# EAGLE design second session (EAGLE 9.6.2)
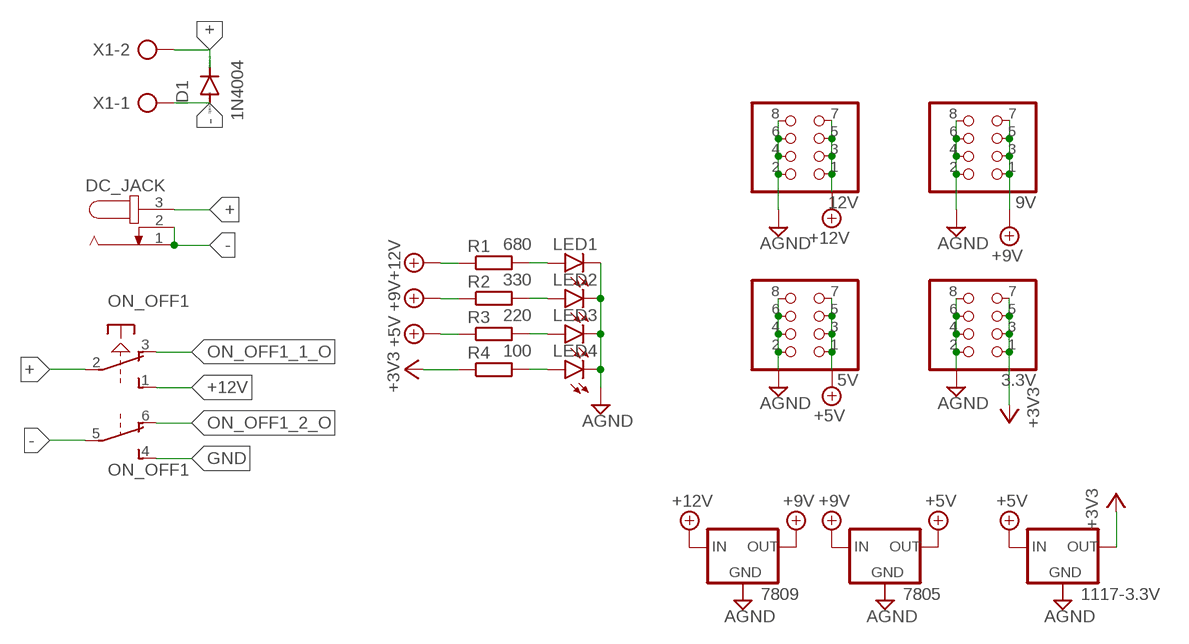
[diagram p0: schematic, sheet 1]

## Parts
3.3V  PINHD-2X4  [2X04]
5V  PINHD-2X4  [2X04]
9V  PINHD-2X4  [2X04]
12V  PINHD-2X4  [2X04]
1117-3.3V  78XXS  [78XXS]
7805  78XXS  [78XXS]
7809  78XXS  [78XXS]
D1  1N4004  [DO41-10]
DC_JACK  JACK-PLUG0  [SPC4077]
LED1  LED5MM  [LED5MM]
LED2  LED5MM  [LED5MM]
LED3  LED5MM  [LED5MM]
LED4  LED5MM  [LED5MM]
ON_OFF1  PVA2R  [PVA2R]
R1  680  R-EU_0207/10  [0207/10]
R2  330  R-EU_0207/10  [0207/10]
R3  220  R-EU_0207/10  [0207/10]
R4  100  R-EU_0207/10  [0207/10]
X1  AK500/2-H  [AK500/2-H]

## Nets
+: D1.C DC_JACK.3 ON_OFF1.2(1:P) X1.2
+3V3: 3.3V.1 3.3V.3 3.3V.5 3.3V.7 1117-3.3V.OUT R4.1
+5V: 5V.1 5V.3 5V.5 5V.7 1117-3.3V.IN 7805.OUT R3.1
+9V: 9V.1 9V.3 9V.5 9V.7 7805.IN 7809.OUT R2.1
+12V: 12V.1 12V.3 12V.5 12V.7 7809.IN ON_OFF1.1(1:S) R1.1
-: D1.A DC_JACK.1 DC_JACK.2 ON_OFF1.5(2:P) X1.1
AGND: 3.3V.2 3.3V.4 3.3V.6 3.3V.8 5V.2 5V.4 5V.6 5V.8 9V.2 9V.4 9V.6 9V.8 12V.2 12V.4 12V.6 12V.8 LED1.K(C) LED2.K(C) LED3.K(C) LED4.K(C)
GND: ON_OFF1.4(2:S)
N$1: LED1.A R1.2
N$2: LED2.A R2.2
N$3: LED3.A R3.2
N$4: LED4.A R4.2
ON_OFF1_1_O: ON_OFF1.3(1:O)
ON_OFF1_2_O: ON_OFF1.6(2:O)
Unconnected: 1117-3.3V.GND 7805.GND 7809.GND

## Library data of the parts
3.3V 5V 9V 12V = pinhead:PINHD-2X4: PIN HEADER
1117-3.3V 7805 7809 = v-reg:78XXS: VOLTAGE REGULATOR
D1 = diode:1N4004: DIODE general purpose rectifier, 1 A
DC_JACK = con-jack:JACK-PLUG: DC POWER JACK Power Jack, DC, Right Angle, Through Hole, Rated 5A at 16VDC, PC Terminals Distributor: Farnell (www.Farnell.de) Drawing: 84N1161.pdf / 84N1162.pdf Manufacturer: SPC Technology (www.spctechnology.com) Type: SPC4077 / SPC 4078; OC_FARNELL: unknown; OC_NEWARK: unknown
LED1-LED4 = led:LED: LED OSRAM: - CHIPLED LG R971, LG N971, LY N971, LG Q971, LY Q971, LO R971, LY R971 LH N974, LH R974 LS Q976, LO Q976, LY Q976 LO Q996 - Hyper CHIPLED LW Q18S LB Q993, LB Q99A, LB R99A - SideLED LS A670, LO A670, LY A670, LG A670, LP A670 LB A673, LV A673, LT A673, LW A673 LH A674 LY A675 LS A676, LA A676, LO A676, LY A676, LW A676 LS A679, LY A679, LG A679 - Hyper Micro SIDELED® LS Y876, LA Y876, LO Y876, LY Y876 LT Y87S - SmartLED LW L88C, LW L88S LB L89C, LB L89S, LG L890 LS L89K, LO L89K, LY L89K LS L896, LA L896, LO L896, LY L896 - TOPLED LS T670, LO T670, LY T670, LG T670, LP T670 LSG T670, LSP T670, LSY T670, LOP T670, LYG T670 LG T671, LOG T671, LSG T671 LB T673, LV T673, LT T673, LW T673 LH T674 LS T676, LA T676, LO T676, LY T676, LB T676, LH T676, LSB T676, LW T676 LB T67C, LV T67C, LT T67C, LS T67K, LO T67K, LY T67K, LW E67C LS E67B, LA E67B, LO E67B, LY E67B, LB E67C, LV E67C, LT E67C LW T67C LS T679, LY T679, LG T679 LS T770, LO T770, LY T770, LG T770, LP T770 LB T773, LV T773, LT T773, LW T773 LH T774 LS E675, LA E675, LY E675, LS T675 LS T776, LA T776, LO T776, LY T776, LB T776 LHGB T686 LT T68C, LB T68C - Hyper Mini TOPLED® LB M676 - Mini TOPLED Santana® LG M470 LS M47K, LO M47K, LY M47K Source: http://www.osram.convergy.de LUXEON: - LUMILED® LXK2-PW12-R00, LXK2-PW12-S00, LXK2-PW14-U00, LXK2-PW14-V00 LXK2-PM12-R00, LXK2-PM12-S00, LXK2-PM14-U00 LXK2-PE12-Q00, LXK2-PE12-R00, LXK2-PE12-S00, LXK2-PE14-T00, LXK2-PE14-U00 LXK2-PB12-K00, LXK2-PB12-L00, LXK2-PB12-M00, LXK2-PB14-N00, LXK2-PB14-P00, LXK2-PB14-Q00 LXK2-PR12-L00, LXK2-PR12-M00, LXK2-PR14-Q00, LXK2-PR14-R00 LXK2-PD12-Q00, LXK2-PD12-R00, LXK2-PD12-S00 LXK2-PH12-R00, LXK2-PH12-S00 LXK2-PL12-P00, LXK2-PL12-Q00, LXK2-PL12-R00 Source: www.luxeon.com KINGBRIGHT: KA-3528ASYC Source: www.kingbright.com
ON_OFF1 = switch-misc:PVA2R: ITT SWITCH
R1-R4 = rcl:R-EU_: RESISTOR, European symbol; SPICEPREFIX: R
X1 = con-ptr500:AK500/2-H: CONNECTOR Aug. 2004 / PTR Meßtechnik: Die Bezeichnung der Serie AK505 wurde geändert. Es handelt sich hierbei um AK500 in horizontaler Ausführung.; OC_FARNELL: unknown; OC_NEWARK: unknown

## Board
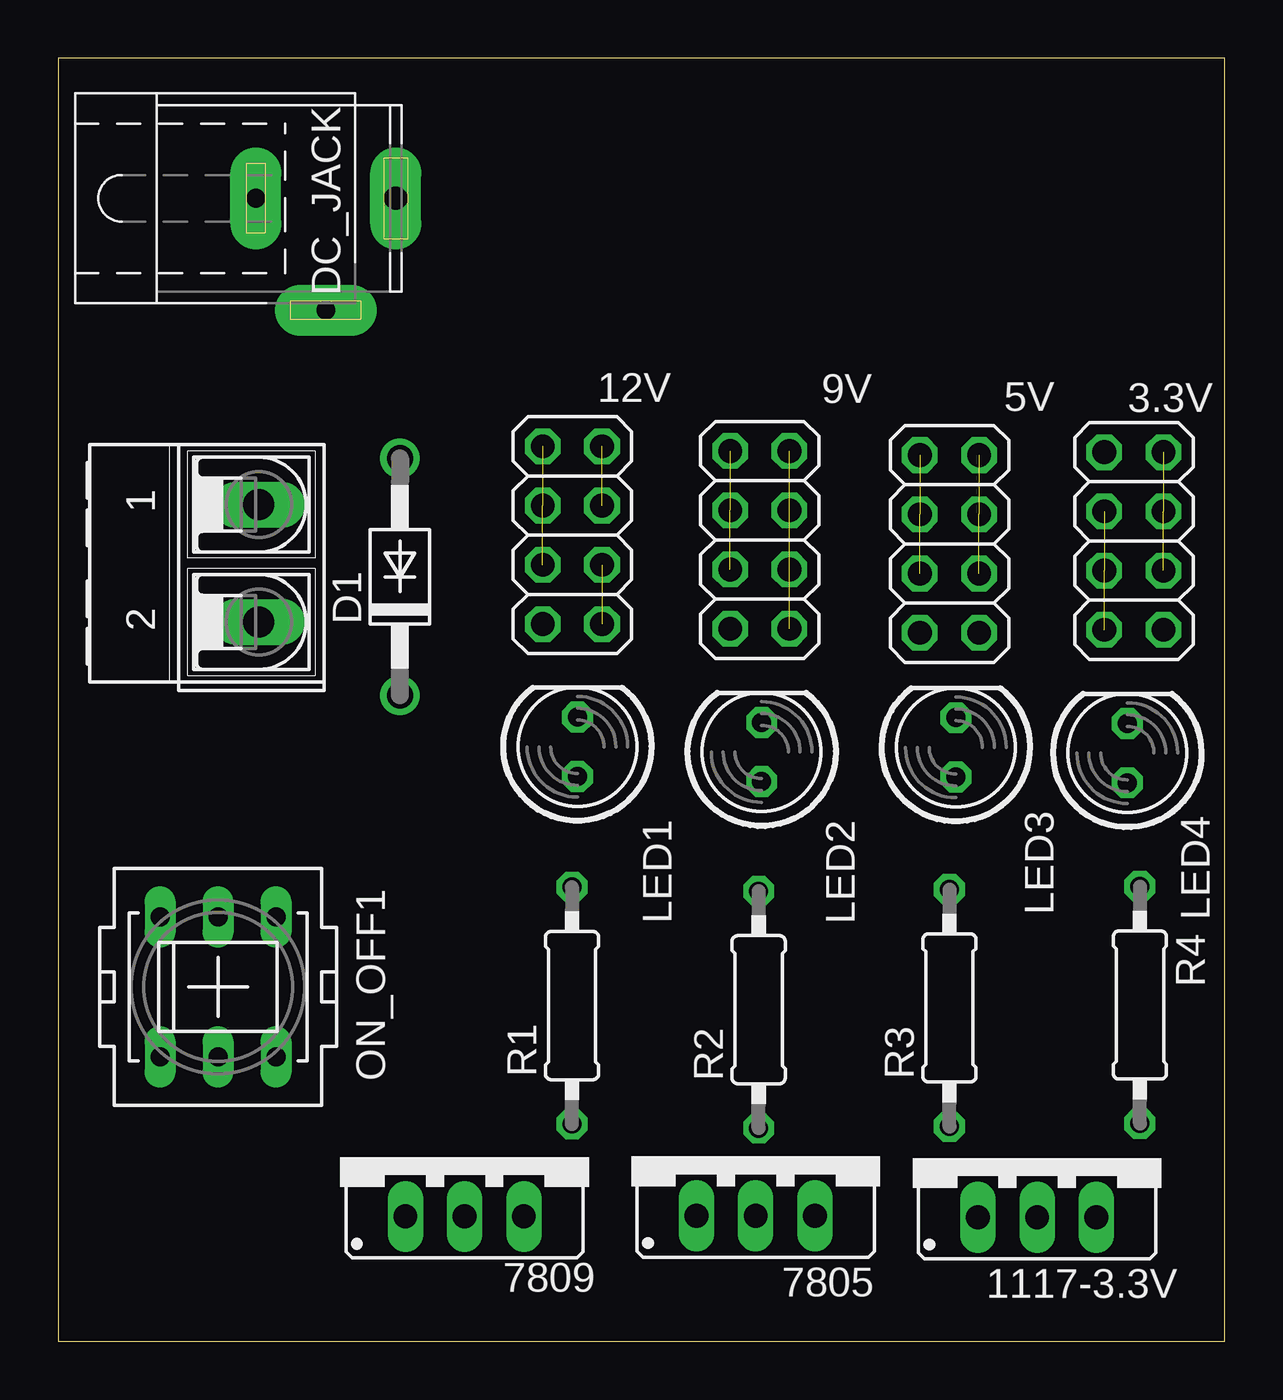
[diagram p1: board, top side]
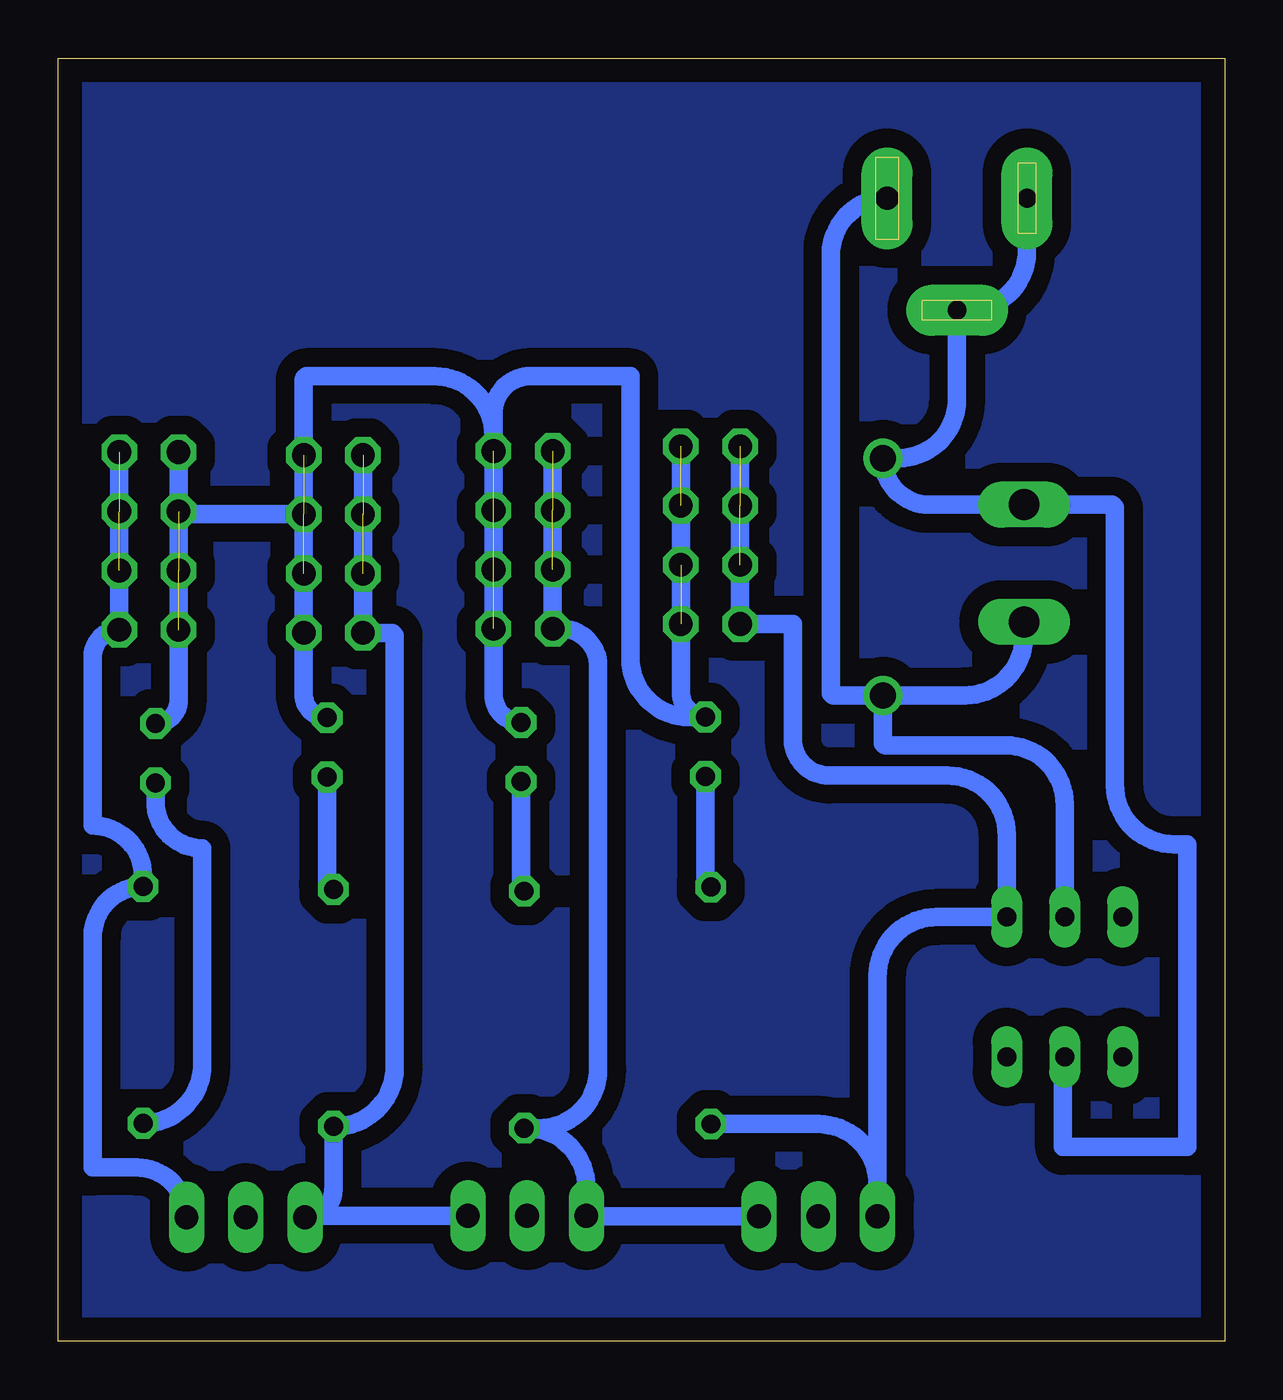
[diagram p2: board, bottom side, seen from below]

Size 50 x 55 mm. Coordinates in mm from the lower left corner, seen from the top.
Outline: 0,0 50,0 50,55 0,55 0,0
Copper layers (1*16): Top 0.035mm / dielectric 1.5mm / Bottom 0.035mm
Design rules "default *": minimum track width 0.8mm, minimum drill 0.7mm, track to track 0.6mm, track to pad 0.6mm, pad to pad 0.6mm, via to via 0.6mm, smd to smd 0.6mm, copper to edge 40mil, drill to drill 6mil, minimum pad ring 10mil, minimum via ring 8mil, stop-mask expansion 4mil, vias tented up to drill 0mil, thermal gap 10mil

### Footprints (pad centres in the part's own frame; a part is rotated, then mirrored left to right if it is on the bottom)
2X04 = drill 1.016 octagon: 1 -3.81,-1.27; 2 -3.81,1.27; 3 -1.27,-1.27; 4 -1.27,1.27; 5 1.27,-1.27; 6 1.27,1.27; 7 3.81,-1.27; 8 3.81,1.27
78XXS = drill 1.016 long: GND 0,-2.54; IN -2.54,-2.54; OUT 2.54,-2.54
DO41-10 = drill 1.118: A 5.08,0; C -5.08,0
SPC4077 = drill 0.8 pad 2.184 long: 1 -3,0; 2 0,-4.8 | drill 1 pad 2.184 long: 3 3,0
LED5MM = drill 0.813 octagon: A -1.27,0; K 1.27,0
PVA2R = drill 0.813 long: 1 -2.997,2.489; 2 -2.997,0; 3 -2.997,-2.489; 4 2.997,2.489; 5 2.997,0; 6 2.997,-2.489
0207/10 = drill 0.813 octagon: 1 -5.08,0; 2 5.08,0
AK500/2-H = drill 1.321 long: 1 -2.515,0; 2 2.515,0

### Placement (x,y rotation side)
3.3V  46.11,34.3 90 top
5V  38.21,34.18 270 top
9V  30.07,34.35 270 top
12V  22.04,34.55 270 top
1117-3.3V  41.97,7.85 0 top
7805  29.9,7.92 0 top
7809  17.42,7.89 0 top
D1  14.64,32.77 90 top
DC_JACK  11.46,49 0 top
LED1  22.25,25.48 90 top
LED2  30.16,25.26 90 top
LED3  38.48,25.46 90 top
LED4  45.84,25.21 90 top
ON_OFF1  6.85,15.19 270 top
R1  22.02,14.39 90 top
R2  30.02,14.21 90 top
R3  38.2,14.29 90 top
R4  46.37,14.41 270 top
X1  8.6,33.35 270 top

### Tracks (layer width: path | path; a pad name or v marks a point on that pad's centre or on a via)
+
  Bottom 0.8: DC_JACK.3 arc-90 16.88,46.59 16.88,27.82 arc-90 16.74,27.69 D1.C | D1.C 11.13,27.69 arc-90 8.6,30.23 X1.2 | ON_OFF1.2 6.85,23.01 arc-90 9.39,25.55 14.53,25.55 arc90 14.64,25.67 D1.C
+3V3  (2 unrouted)
  Bottom 0.8: 1117-3.3V.OUT arc-90 46.65,7.45 48.52,7.45 48.52,17.34 arc90 R4.1 46.37,19.95 arc-90 48.52,22.1 48.52,29.36 arc90 3.3V.1 3.3V.7
+5V  (2 unrouted)
  Bottom 0.8: 7805.OUT 39.36,5.38 arc-90 1117-3.3V.IN arc-90 38.2,6.53 R3.1 38.12,9.21 arc-90 35.58,11.75 35.58,30.18 arc-90 35.77,30.37 5V.7 5V.1
+9V  (2 unrouted)
  Bottom 0.8: 7809.OUT 27.34,5.35 arc90 7805.IN 27.36,6.59 arc-90 29.9,9.13 R2.1 29.39,9.13 arc-90 26.85,11.67 26.85,28.95 arc-90 28.45,30.55 9V.7 9V.1
+12V  (2 unrouted)
  Bottom 0.8: 12V.1 12V.7 18.52,30.75 arc90 18.5,30.73 18.5,25.8 arc-90 16.95,24.25 11.88,24.25 arc90 9.34,21.71 ON_OFF1.1 12.34,18.19 arc-90 14.88,15.65 7809.IN 14.88,6.77 arc-90 17.42,9.31 R1.1
-
  Bottom 0.8: DC_JACK.1 8.46,46.74 arc90 11.01,44.2 DC_JACK.2 11.46,40.39 arc90 14.01,37.85 D1.A arc-90 12.66,35.87 X1.1 4.89,35.87 arc90 4.7,35.67 4.7,23.84 arc-90 2.16,21.3 1.6,21.3 1.6,8.32 6.92,8.32 6.92,12.12 arc90 ON_OFF1.5
AGND  (9 unrouted)
  Bottom 0.8: LED2.K arc90 31.34,27.72 9V.8 31.34,39.78 arc90 29.75,41.38 25.48,41.38 25.48,29.3 arc-90 22.93,26.75 LED1.K arc90 23.31,27.81 12V.8 12V.2 | LED3.K arc90 39.48,27.73 5V.8 5V.2 39.48,41.2 arc90 39.3,41.38 33.88,41.38 arc90 31.34,38.84 9V.2 | 5V.4 44.72,35.45 arc90 3.3V.6 | 3.3V.8 3.3V.2 44.84,27.47 arc90 LED4.K
N$1
  Bottom 0.8: R1.2 arc90 22.25,19.7 LED1.A
N$2
  Bottom 0.8: LED2.A 30.16,19.42 arc-90 R2.2
N$3
  Bottom 0.8: LED3.A 38.48,19.64 arc-90 R3.2
N$4
  Bottom 0.8: LED4.A 45.84,23.14 arc-90 43.83,21.12 43.83,11.87 arc90 R4.2
X
  pour Bottom (isolate 0.8): 0,55 0,-0.1 49.85,-0.1 50,0.05 50,54.8 49.95,54.85 0.15,54.85